# Altium schematic sheet ReferenceVoltage.SchDoc: Precision, low drift, 2.5V Reference Voltage
size A4; Author: M. Gumiela, G. Gajoch; DocumentNumber: 11; SheetNumber: 11; SheetTotal: 16; Model: EM1; PageSetup: Record=PageOptions|CenterHorizontal=True|CenterVertical=True|PrintScale=0.52|XCorrection=1.00|YCorrection=1.00|PrintKind=1|BorderSize=5000000|LeftOffset=0|BottomOffset=0|Orientation=2|PaperLength=4200|PaperWidth=2970|Scale=100|PaperSource=7|PrintQuality=600|MediaType=1|DitherType=10|PaperKind=A3|PrintScaleMode=1
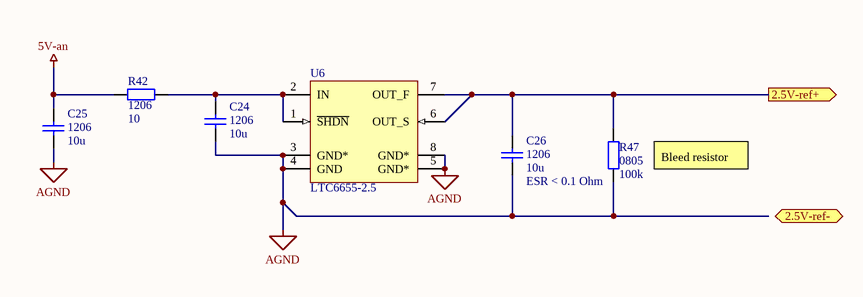
[diagram p0: ReferenceVoltage.SchDoc]

## Parts
C24  1206  value 10u  [SMD_Capacitor_1206]
C25  1206  value 10u  [SMD_Capacitor_1206]
C26  ESR < 0.1 Ohm  value 10u  [SMD_Capacitor_1206]
R42  1206  value 10  [SMD_Resistor_1206]
R47  0805  value 100k  [SMD_Resistor_0805]
U6  LTC6655-2.5  [MSOP-8]

## Ports
2.5V-ref+ (out), 2.5V-ref- (in)

## Nets
5V-an: C25.2 R42.1
AGND: C24.1 C25.1 C26.1 R47.1 U6.3(GND*) U6.4(GND) U6.5(GND*) U6.8(GND*)
2.5V-ref+: C26.2 R47.2 U6.6(OUT_S) U6.7(OUT_F) ; port 2.5V-ref+
NetC24_2: C24.2 R42.2 U6.1(~{SHDN}) U6.2(IN)

## Notes on the sheet
- (near R47) Bleed resistor
- Title:
- Sheet:
- of
- Author:
- Model:
- Document Number:
- Checked by:
- Iss-Rev:
- Approved by:
- Date:
- File name:

## Library data of the parts
C24-C26 = Cap: Capacitor; Published: 8-Jun-2000; LatestRevisionDate: 17-Jul-2002; LatestRevisionNote: Re-released for DXP Platform.; PackageReference: RAD-0.3; Publisher: Altium Limited; PackageDescription: Radial Cap, Thru-Hole; 2 Leads; 0.3 in Pin Spacing
R42 R47 = Res2: Resistor; Published: 8-Jun-2000; LatestRevisionDate: 17-Jul-2002; LatestRevisionNote: Re-released for DXP Platform.; PackageReference: AXIAL-0.4; Publisher: Altium Limited; PackageDescription: Axial Device, Thru-Hole; 2 Leads; 0.4 in Pin Spacing
U6 = LTC6655-2.5: 0.25ppm Noise, Low Drift  Precision References; PartNumber: LTC6655-2.5; ComponentLink1Description: Manufacturer URL; ComponentLink1URL: http://www.linear.com/; ComponentLink2Description: Datasheet; ComponentLink2URL: http://cds.linear.com/docs/en/datasheet/6655fe.pdf